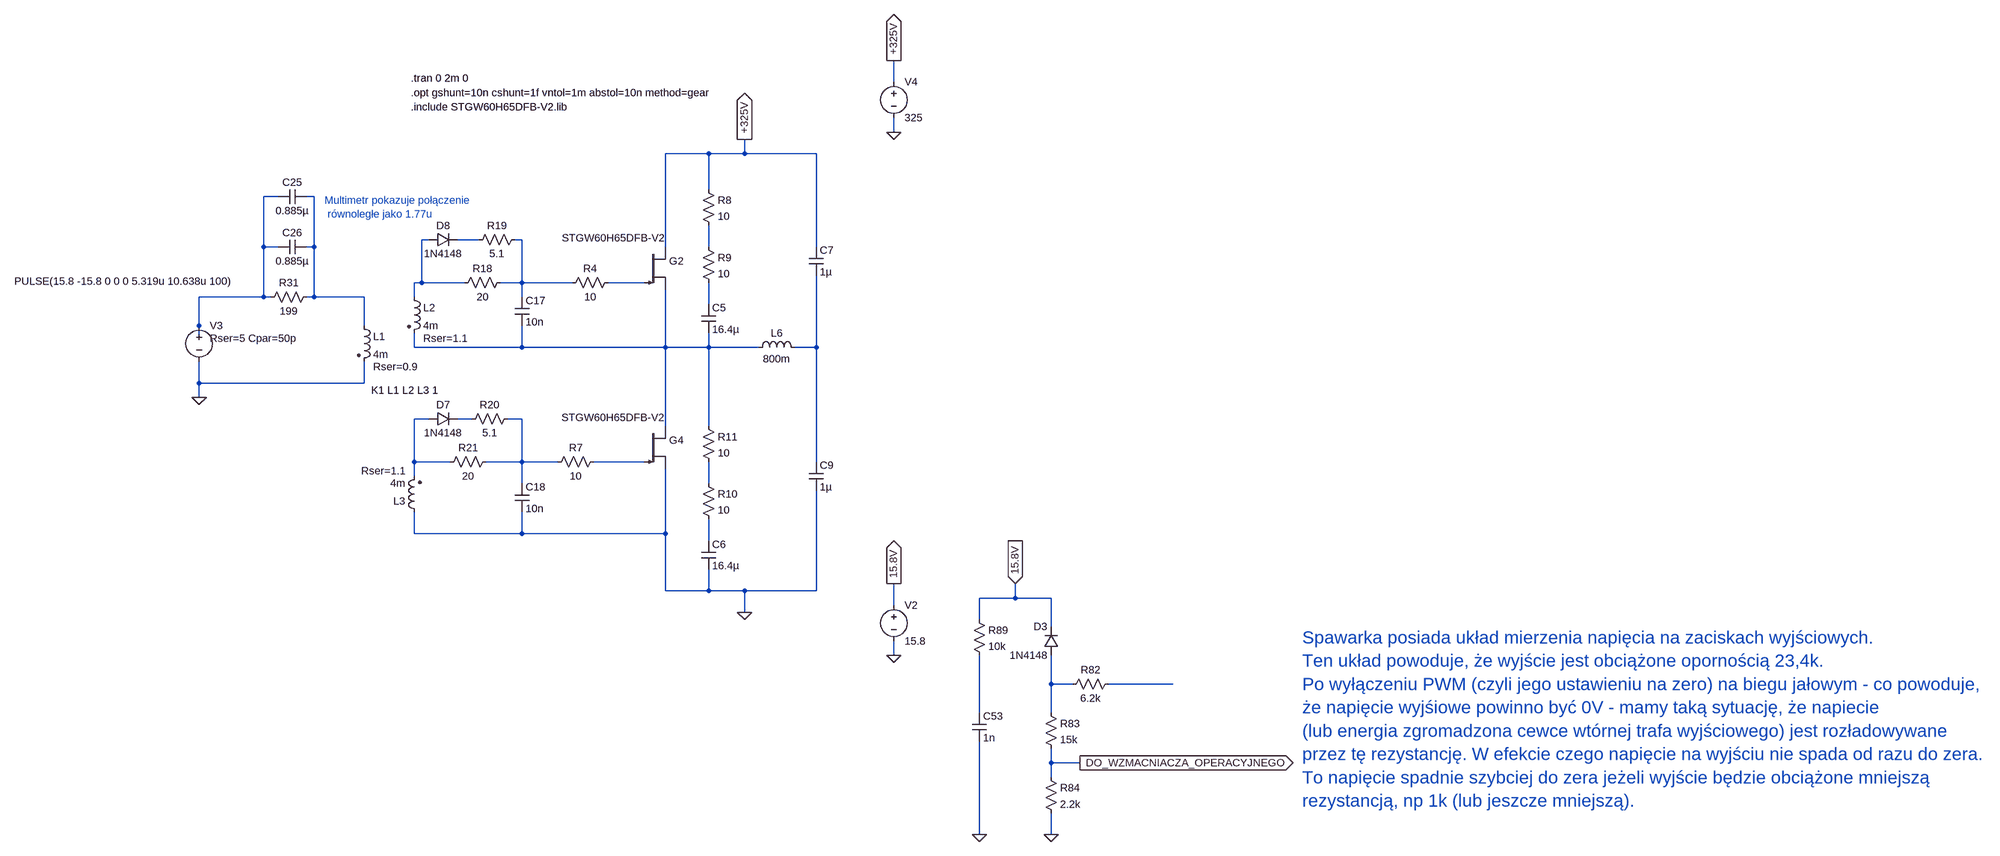
[diagram p0: schematic igbt.asc]
igbt.asc, the LTspice schematic file:
Version 4
SHEET 1 2256 1332
WIRE -272 -368 -272 -416
WIRE -272 -256 -272 -288
WIRE -720 -208 -816 -208
WIRE -640 -208 -640 -240
WIRE -640 -208 -720 -208
WIRE -480 -208 -640 -208
WIRE -720 -128 -720 -208
WIRE -1680 -112 -1712 -112
WIRE -1600 -112 -1616 -112
WIRE -1344 -16 -1360 -16
WIRE -1232 -16 -1280 -16
WIRE -1136 -16 -1152 -16
WIRE -1712 0 -1712 -112
WIRE -1680 0 -1712 0
WIRE -1600 0 -1600 -112
WIRE -1600 0 -1616 0
WIRE -816 0 -816 -208
WIRE -720 0 -720 -48
WIRE -480 0 -480 -208
WIRE -1360 80 -1360 -16
WIRE -1360 80 -1376 80
WIRE -1264 80 -1360 80
WIRE -1136 80 -1136 -16
WIRE -1136 80 -1184 80
WIRE -1024 80 -1136 80
WIRE -864 80 -944 80
WIRE -1712 112 -1712 0
WIRE -1712 112 -1856 112
WIRE -1696 112 -1712 112
WIRE -1600 112 -1600 0
WIRE -1600 112 -1616 112
WIRE -1488 112 -1600 112
WIRE -1376 112 -1376 80
WIRE -1136 112 -1136 80
WIRE -720 128 -720 80
WIRE -1856 176 -1856 112
WIRE -1488 176 -1488 112
WIRE -1856 208 -1856 176
WIRE -1376 224 -1376 192
WIRE -1136 224 -1136 176
WIRE -1136 224 -1376 224
WIRE -816 224 -816 96
WIRE -816 224 -1136 224
WIRE -720 224 -720 192
WIRE -720 224 -816 224
WIRE -608 224 -720 224
WIRE -480 224 -480 64
WIRE -480 224 -528 224
WIRE -1856 304 -1856 256
WIRE -1488 304 -1488 256
WIRE -1488 304 -1856 304
WIRE -1856 336 -1856 304
WIRE -1344 384 -1376 384
WIRE -1248 384 -1280 384
WIRE -1136 384 -1168 384
WIRE -816 400 -816 224
WIRE -720 400 -720 224
WIRE -1376 480 -1376 384
WIRE -1296 480 -1376 480
WIRE -1136 480 -1136 384
WIRE -1136 480 -1216 480
WIRE -1056 480 -1136 480
WIRE -864 480 -976 480
WIRE -480 480 -480 224
WIRE -1376 512 -1376 480
WIRE -1136 528 -1136 480
WIRE -720 528 -720 480
WIRE -1376 640 -1376 592
WIRE -1136 640 -1136 592
WIRE -1136 640 -1376 640
WIRE -816 640 -816 496
WIRE -816 640 -1136 640
WIRE -720 656 -720 608
WIRE -816 768 -816 640
WIRE -720 768 -720 720
WIRE -720 768 -816 768
WIRE -640 768 -720 768
WIRE -480 768 -480 544
WIRE -480 768 -640 768
WIRE 32 784 32 752
WIRE 32 784 -48 784
WIRE 112 784 32 784
WIRE -272 800 -272 752
WIRE -640 816 -640 768
WIRE -48 832 -48 784
WIRE 112 848 112 784
WIRE -272 912 -272 880
WIRE 112 976 112 912
WIRE 160 976 112 976
WIRE 384 976 240 976
WIRE -48 1040 -48 912
WIRE 112 1040 112 976
WIRE 112 1152 112 1120
WIRE 176 1152 112 1152
WIRE 112 1184 112 1152
WIRE -48 1312 -48 1104
WIRE 112 1312 112 1264
FLAG 112 1312 0
FLAG -272 912 0
FLAG -272 752 15.8V
IOPIN -272 752 Out
FLAG 32 752 15.8V
IOPIN 32 752 In
FLAG -48 1312 0
FLAG 176 1152 DO_WZMACNIACZA_OPERACYJNEGO
IOPIN 176 1152 Out
FLAG -1856 336 0
FLAG -640 816 0
FLAG -272 -256 0
FLAG -272 -416 +325V
IOPIN -272 -416 Out
FLAG -640 -240 +325V
IOPIN -640 -240 Out
SYMBOL res 256 960 R90
WINDOW 0 0 56 VBottom 2
WINDOW 3 32 56 VTop 2
SYMATTR InstName R82
SYMATTR Value 6.2k
SYMBOL res 96 1024 R0
SYMATTR InstName R83
SYMATTR Value 15k
SYMBOL res 96 1168 R0
SYMATTR InstName R84
SYMATTR Value 2.2k
SYMBOL voltage -272 784 R0
WINDOW 123 0 0 Left 0
WINDOW 39 0 0 Left 0
SYMATTR InstName V2
SYMATTR Value 15.8
SYMBOL diode 128 912 R180
WINDOW 0 24 64 Left 2
WINDOW 3 24 0 Left 2
SYMATTR InstName D3
SYMATTR Value 1N4148
SYMBOL res -64 816 R0
SYMATTR InstName R89
SYMATTR Value 10k
SYMBOL cap -64 1040 R0
SYMATTR InstName C53
SYMATTR Value 1n
SYMBOL voltage -1856 160 R0
WINDOW 123 0 0 Left 0
WINDOW 39 24 44 Left 2
WINDOW 3 -412 -83 Left 2
SYMATTR SpiceLine Rser=5 Cpar=50p
SYMATTR Value PULSE(15.8 -15.8 0 0 0 5.319u 10.638u 100)
SYMATTR InstName V3
SYMBOL ind2 -1504 160 R0
WINDOW 39 36 108 Left 2
SYMATTR InstName L1
SYMATTR Value 4m
SYMATTR Type ind
SYMATTR SpiceLine Rser=0.9
SYMBOL res -1600 96 R90
WINDOW 0 0 56 VBottom 2
WINDOW 3 32 56 VTop 2
SYMATTR InstName R31
SYMATTR Value 199
SYMBOL cap -1616 -16 R90
WINDOW 0 0 32 VBottom 2
WINDOW 3 32 32 VTop 2
SYMATTR InstName C26
SYMATTR Value 0.885µ
SYMBOL cap -1616 -128 R90
WINDOW 0 0 32 VBottom 2
WINDOW 3 32 32 VTop 2
SYMATTR InstName C25
SYMATTR Value 0.885µ
SYMBOL ind2 -1392 96 R0
WINDOW 39 36 108 Left 2
SYMATTR InstName L2
SYMATTR Value 4m
SYMATTR Type ind
SYMATTR SpiceLine Rser=1.1
SYMBOL res -1168 64 R90
WINDOW 0 0 56 VBottom 2
WINDOW 3 32 56 VTop 2
SYMATTR InstName R18
SYMATTR Value 20
SYMBOL cap -1152 112 R0
SYMATTR InstName C17
SYMATTR Value 10n
SYMBOL diode -1344 0 R270
WINDOW 0 32 32 VTop 2
WINDOW 3 0 32 VBottom 2
SYMATTR InstName D8
SYMATTR Value 1N4148
SYMBOL res -1136 -32 R90
WINDOW 0 0 56 VBottom 2
WINDOW 3 32 56 VTop 2
SYMATTR InstName R19
SYMATTR Value 5.1
SYMBOL res -928 64 R90
WINDOW 0 0 56 VBottom 2
WINDOW 3 32 56 VTop 2
SYMATTR InstName R4
SYMATTR Value 10
SYMBOL Misc\\NIGBT -864 0 R0
WINDOW 3 -183 -20 Left 2
SYMATTR InstName G2
SYMATTR Value STGW60H65DFB-V2
SYMATTR Prefix X
SYMBOL voltage -272 -384 R0
WINDOW 123 0 0 Left 0
WINDOW 39 0 0 Left 0
SYMATTR InstName V4
SYMATTR Value 325
SYMBOL ind -624 240 R270
WINDOW 0 32 56 VTop 2
WINDOW 3 5 56 VBottom 2
SYMATTR InstName L6
SYMATTR Value 800m
SYMBOL cap -496 480 R0
SYMATTR InstName C9
SYMATTR Value 1µ
SYMBOL cap -496 0 R0
SYMATTR InstName C7
SYMATTR Value 1µ
SYMBOL res -736 -144 R0
SYMATTR InstName R8
SYMATTR Value 10
SYMBOL res -736 -16 R0
SYMATTR InstName R9
SYMATTR Value 10
SYMBOL cap -736 128 R0
SYMATTR InstName C5
SYMATTR Value 16.4µ
SYMBOL ind2 -1360 608 R180
WINDOW 39 36 108 Left 2
SYMATTR InstName L3
SYMATTR Value 4m
SYMATTR Type ind
SYMATTR SpiceLine Rser=1.1
SYMBOL diode -1344 400 R270
WINDOW 0 32 32 VTop 2
WINDOW 3 0 32 VBottom 2
SYMATTR InstName D7
SYMATTR Value 1N4148
SYMBOL res -1152 368 R90
WINDOW 0 0 56 VBottom 2
WINDOW 3 32 56 VTop 2
SYMATTR InstName R20
SYMATTR Value 5.1
SYMBOL res -1200 464 R90
WINDOW 0 0 56 VBottom 2
WINDOW 3 32 56 VTop 2
SYMATTR InstName R21
SYMATTR Value 20
SYMBOL res -960 464 R90
WINDOW 0 0 56 VBottom 2
WINDOW 3 32 56 VTop 2
SYMATTR InstName R7
SYMATTR Value 10
SYMBOL Misc\\NIGBT -864 400 R0
WINDOW 3 -184 -19 Left 2
SYMATTR InstName G4
SYMATTR Value STGW60H65DFB-V2
SYMATTR Prefix X
SYMBOL res -736 384 R0
SYMATTR InstName R11
SYMATTR Value 10
SYMBOL res -736 512 R0
SYMATTR InstName R10
SYMATTR Value 10
SYMBOL cap -736 656 R0
SYMATTR InstName C6
SYMATTR Value 16.4µ
SYMBOL cap -1152 528 R0
SYMATTR InstName C18
SYMATTR Value 10n
TEXT -1384 -376 Left 2 !.tran 0 2m 0
TEXT -1384 -312 Left 2 !.include STGW60H65DFB-V2.lib
TEXT 672 872 Left 4 ;Spawarka posiada układ mierzenia napięcia na zaciskach wyjściowych.\nTen układ powoduje, że wyjście jest obciążone opornością 23,4k.\nPo wyłączeniu PWM (czyli jego ustawieniu na zero) na biegu jałowym - co powoduje,\nże napięcie wyjśiowe powinno być 0V - mamy taką sytuację, że napiecie\n(lub energia zgromadzona cewce wtórnej trafa wyjściowego) jest rozładowywane\nprzez tę rezystancję. W efekcie czego napięcie na wyjściu nie spada od razu do zera.\nTo napięcie spadnie szybciej do zera jeżeli wyjście będzie obciążone mniejszą\nrezystancją, np 1k (lub jeszcze mniejszą).
TEXT -1576 -104 Left 2 ;Multimetr pokazuje połączenie\n równoległe jako 1.77u
TEXT -1472 320 Left 2 !K1 L1 L2 L3 1
TEXT -1384 -344 Left 2 !.opt gshunt=10n cshunt=1f vntol=1m abstol=10n method=gear

The netlist it stands for:
* igbt.asc
R82 N018 N017 6.2k
R83 N017 DO_WZMACNIACZA_OPERACYJNEGO 15k
R84 DO_WZMACNIACZA_OPERACYJNEGO 0 2.2k
V2 15.8V 0 15.8
D3 N017 15.8V 1N4148
R89 15.8V N019 10k
C53 N019 0 1n
V3 N001 0 PULSE(15.8 -15.8 0 0 0 5.319u 10.638u 100) Rser=5 Cpar=50p
L1 N002 0 4m Rser=0.9
R31 N002 N001 199
C26 N002 N001 0.885µ
C25 N002 N001 0.885µ
L2 N003 N009 4m Rser=1.1
R18 N005 N003 20
C17 N005 N009 10n
D8 N003 N004 1N4148
R19 N005 N004 5.1
R4 N007 N005 10
XG2 +325V N007 N009 STGW60H65DFB-V2  ; pins C G E
V4 +325V 0 325
L6 N009 N010 800m
C9 N010 0 1µ
C7 +325V N010 1µ
R8 +325V N006 10
R9 N006 N008 10
C5 N008 N009 16.4µ
L3 0 N011 4m Rser=1.1
D7 N011 N012 1N4148
R20 N013 N012 5.1
R21 N013 N011 20
R7 N014 N013 10
XG4 N009 N014 0 STGW60H65DFB-V2  ; pins C G E
R11 N009 N015 10
R10 N015 N016 10
C6 N016 0 16.4µ
C18 N013 0 10n
.model D D
.lib standard.dio
.tran 0 2m 0
.include STGW60H65DFB-V2.lib
* Spawarka posiada układ mierzenia napięcia na zaciskach wyjściowych.
* Ten układ powoduje, że wyjście jest obciążone opornością 23,4k.
* Po wyłączeniu PWM (czyli jego ustawieniu na zero) na biegu jałowym - co powoduje,
* że napięcie wyjśiowe powinno być 0V - mamy taką sytuację, że napiecie
* (lub energia zgromadzona cewce wtórnej trafa wyjściowego) jest rozładowywane
* przez tę rezystancję. W efekcie czego napięcie na wyjściu nie spada od razu do zera.
* To napięcie spadnie szybciej do zera jeżeli wyjście będzie obciążone mniejszą
* rezystancją, np 1k (lub jeszcze mniejszą).
* Multimetr pokazuje połączenie
*  równoległe jako 1.77u
K1 L1 L2 L3 1
.opt gshunt=10n cshunt=1f vntol=1m abstol=10n method=gear
.backanno
.end